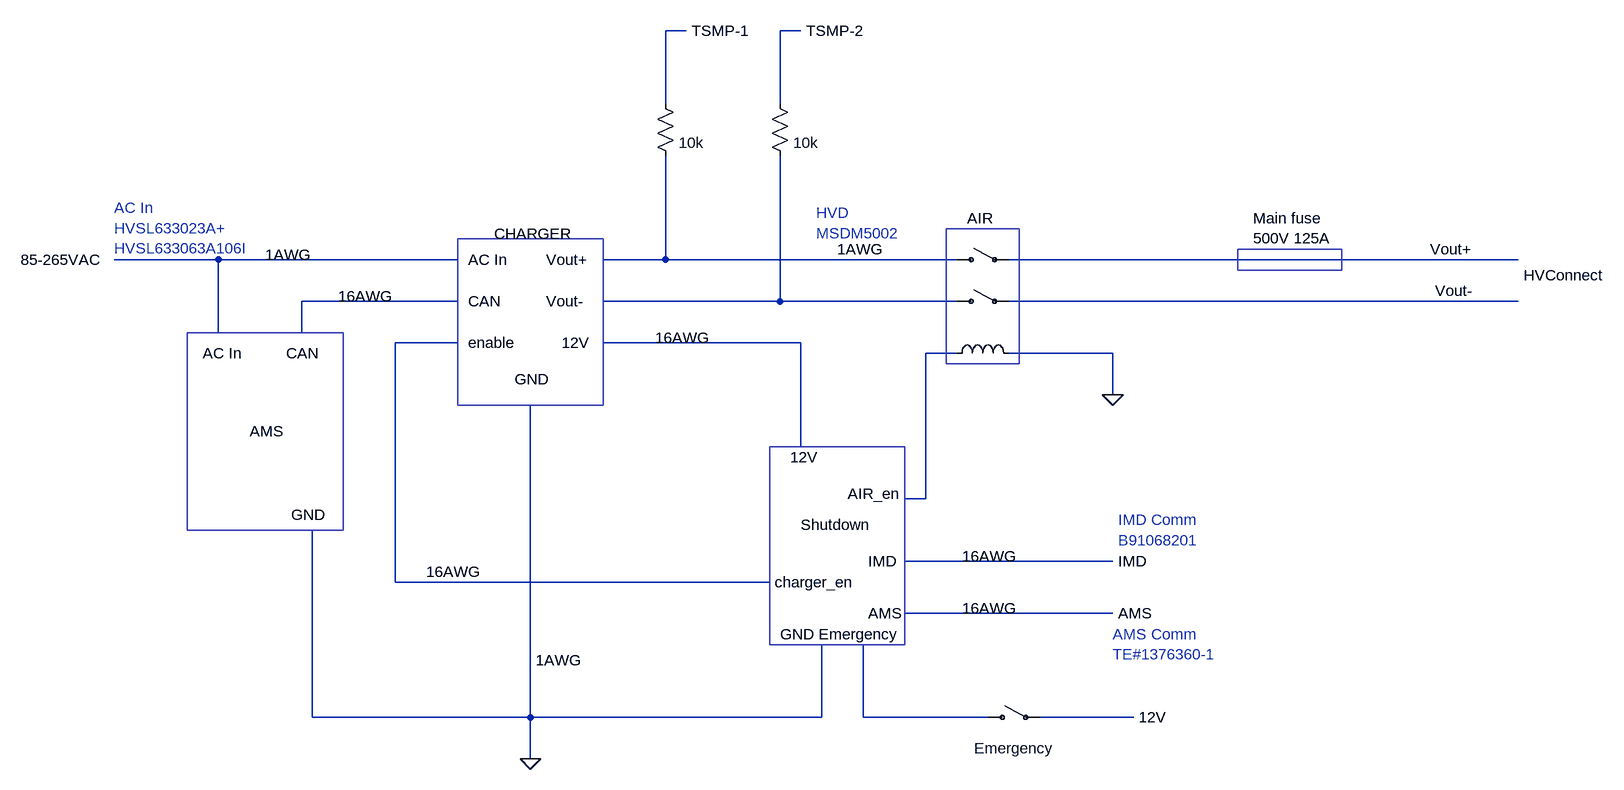
[diagram p0: schematic Charging Tractive System Schematic RM27.asc]
Charging Tractive System Schematic RM27.asc, the LTspice schematic file:
Version 4
SHEET 1 2464 916
WIRE 1040 -224 1008 -224
WIRE 1216 -224 1184 -224
WIRE 1008 -112 1008 -224
WIRE 1184 -112 1184 -224
WIRE 320 128 160 128
WIRE 688 128 320 128
WIRE 1008 128 1008 -32
WIRE 1008 128 912 128
WIRE 1456 128 1008 128
WIRE 2320 128 1536 128
WIRE 688 192 448 192
WIRE 1184 192 1184 -32
WIRE 1184 192 912 192
WIRE 1456 192 1184 192
WIRE 2320 192 1536 192
WIRE 320 240 320 128
WIRE 448 240 448 192
WIRE 688 256 592 256
WIRE 1216 256 912 256
WIRE 1456 272 1408 272
WIRE 1696 272 1536 272
WIRE 1696 336 1696 272
WIRE 1216 416 1216 256
WIRE 1408 496 1408 272
WIRE 1408 496 1376 496
WIRE 1696 592 1376 592
WIRE 592 624 592 256
WIRE 1168 624 592 624
WIRE 1696 672 1376 672
WIRE 464 832 464 544
WIRE 800 832 800 352
WIRE 800 832 464 832
WIRE 1248 832 1248 720
WIRE 1248 832 800 832
WIRE 1312 832 1312 720
WIRE 1504 832 1312 832
WIRE 1728 832 1584 832
WIRE 800 896 800 832
FLAG 800 896 0
FLAG 1696 336 0
SYMBOL csw 1504 832 R270
WINDOW 0 32 40 Invisible 2
WINDOW 3 -32 40 VBottom 2
SYMATTR InstName W1
SYMATTR Value Emergency
SYMBOL ind 1440 288 R270
WINDOW 0 32 56 Invisible 2
WINDOW 3 5 56 Invisible 2
SYMATTR InstName L1
SYMBOL csw 1456 192 R270
WINDOW 0 32 40 Invisible 2
WINDOW 3 -32 40 Invisible 2
SYMATTR InstName W2
SYMBOL csw 1456 128 R270
WINDOW 0 32 40 Invisible 2
WINDOW 3 -32 40 Invisible 2
SYMATTR InstName W3
SYMBOL res 1168 -128 R0
WINDOW 0 36 40 Invisible 2
SYMATTR InstName R1
SYMATTR Value 10k
SYMBOL res 992 -128 R0
WINDOW 0 36 40 Invisible 2
SYMATTR InstName R2
SYMATTR Value 10k
TEXT 16 128 Left 2 !85-265VAC
TEXT 296 272 Left 2 !AC In
TEXT 424 272 Left 2 !CAN
TEXT 368 392 Left 2 !AMS
TEXT 432 520 Left 2 !GND
TEXT 704 128 Left 2 !AC In
TEXT 704 192 Left 2 !CAN
TEXT 504 184 Left 2 !16AWG
TEXT 392 120 Left 2 !1AWG
TEXT 824 128 Left 2 !Vout+
TEXT 824 192 Left 2 !Vout-
TEXT 704 256 Left 2 !enable
TEXT 848 256 Left 2 !12V
TEXT 776 312 Left 2 !GND
TEXT 1184 704 Left 2 !GND Emergency
TEXT 1176 624 Left 2 !charger_en
TEXT 1320 672 Left 2 !AMS
TEXT 1320 592 Left 2 !IMD
TEXT 1216 536 Left 2 !Shutdown
TEXT 1288 488 Left 2 !AIR_en
TEXT 1200 432 Left 2 !12V
TEXT 1464 584 Left 2 !16AWG
TEXT 1464 664 Left 2 !16AWG
TEXT 1704 592 Left 2 !IMD
TEXT 1704 672 Left 2 !AMS
TEXT 1736 832 Left 2 !12V
TEXT 2192 176 Left 2 !Vout-
TEXT 2184 112 Left 2 !Vout+
TEXT 2328 152 Left 2 !HVConnect
TEXT 1912 64 Left 2 !Main fuse\n500V 125A
TEXT 1472 64 Left 2 !AIR
TEXT 1272 112 Left 2 !1AWG
TEXT 744 88 Left 2 !CHARGER
TEXT 808 744 Left 2 !1AWG
TEXT 1048 -224 Left 2 !TSMP-1
TEXT 1224 -224 Left 2 !TSMP-2
TEXT 640 608 Left 2 !16AWG
TEXT 992 248 Left 2 !16AWG
TEXT 160 48 Left 2 ;AC In\nHVSL633023A+\nHVSL633063A106I
TEXT 1240 56 Left 2 ;HVD\nMSDM5002
TEXT 1696 704 Left 2 ;AMS Comm\nTE#1376360-1
TEXT 1704 528 Left 2 ;IMD Comm\nB91068201
RECTANGLE Normal 512 544 272 240
RECTANGLE Normal 912 352 688 96
RECTANGLE Normal 1376 720 1168 416
RECTANGLE Normal 2048 144 1888 112
RECTANGLE Normal 1552 80 1440 288

The netlist it stands for:
* Charging Tractive System Schematic RM27.asc
W1 N014 N015 Emergency
L1 N011 0 L
W2 N007 N008 CSW
W3 N004 N005 CSW
R1 N002 N007 10k
R2 N001 N004 10k
85-265VAC
AC In
CAN
AMS
GND
AC In
CAN
16AWG
1AWG
Vout+
Vout-
enable
12V
GND
GND Emergency
charger_en
AMS
IMD
Shutdown
AIR_en
12V
16AWG
16AWG
IMD
AMS
12V
Vout-
Vout+
HVConnect
Main fuse
500V 125A
AIR
1AWG
CHARGER
1AWG
TSMP-1
TSMP-2
16AWG
16AWG
* AC In
* HVSL633023A+
* HVSL633063A106I
* HVD
* MSDM5002
* AMS Comm
* TE#1376360-1
* IMD Comm
* B91068201
.backanno
.end